# EAGLE schematic schematic (EAGLE 6.5.0)
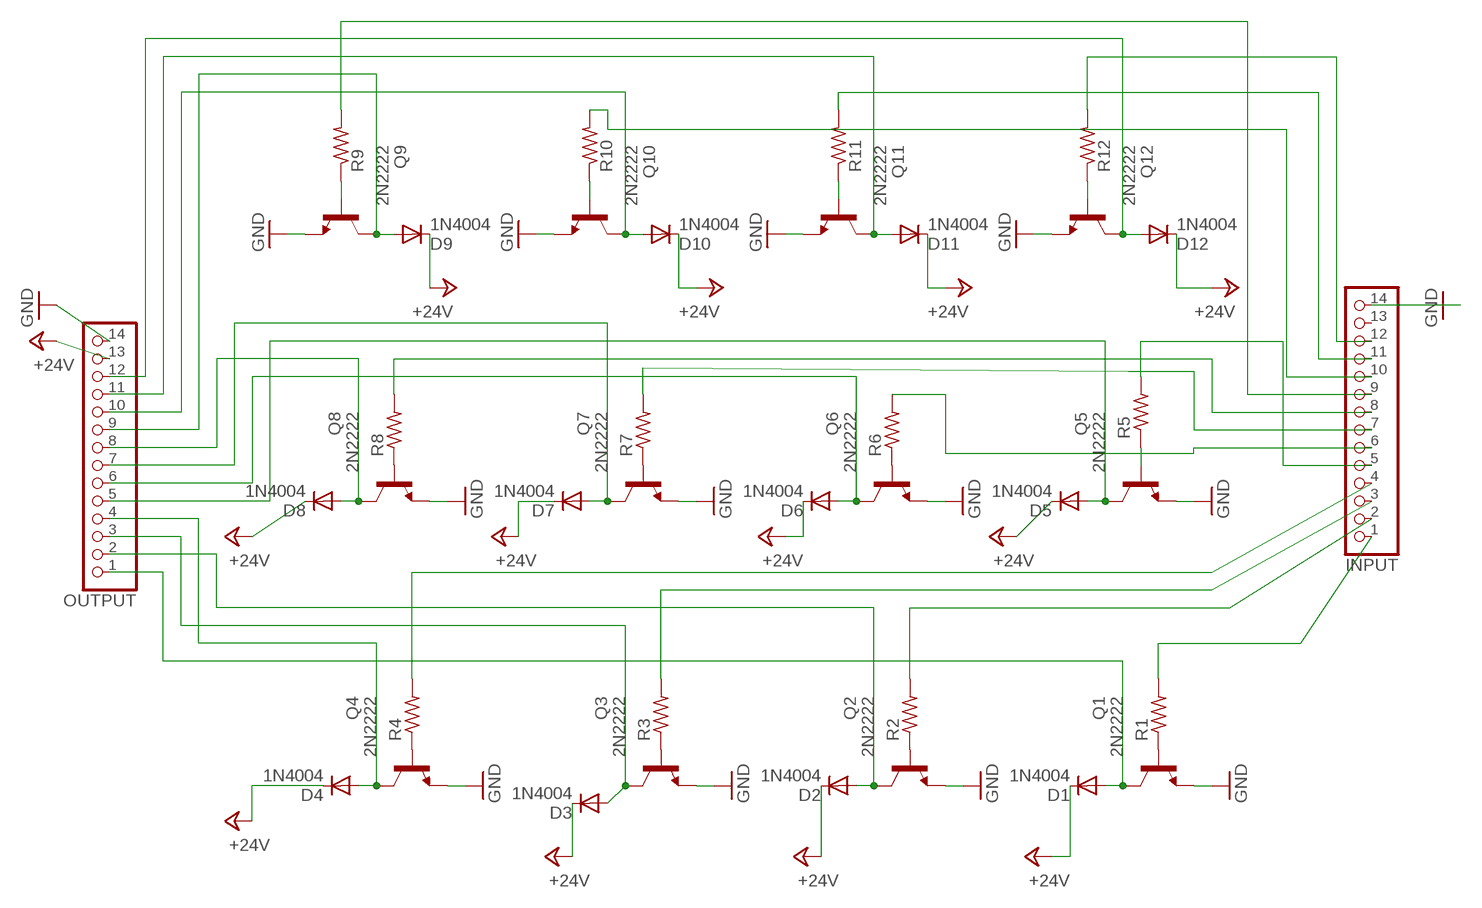
[diagram p0: schematic, sheet 1]

## Parts
D1  1N4004  [DO41-10]
D2  1N4004  [DO41-10]
D3  1N4004  [DO41-10]
D4  1N4004  [DO41-10]
D5  1N4004  [DO41-10]
D6  1N4004  [DO41-10]
D7  1N4004  [DO41-10]
D8  1N4004  [DO41-10]
D9  1N4004  [DO41-10]
D10  1N4004  [DO41-10]
D11  1N4004  [DO41-10]
D12  1N4004  [DO41-10]
INPUT  PINHD-1X14  [1X14]
OUTPUT  PINHD-1X14  [1X14]
Q1  2N2222  [TO92-EBC-OVAL]
Q2  2N2222  [TO92-EBC-OVAL]
Q3  2N2222  [TO92-EBC-OVAL]
Q4  2N2222  [TO92-EBC-OVAL]
Q5  2N2222  [TO92-EBC-OVAL]
Q6  2N2222  [TO92-EBC-OVAL]
Q7  2N2222  [TO92-EBC-OVAL]
Q8  2N2222  [TO92-EBC-OVAL]
Q9  2N2222  [TO92-EBC-OVAL]
Q10  2N2222  [TO92-EBC-OVAL]
Q11  2N2222  [TO92-EBC-OVAL]
Q12  2N2222  [TO92-EBC-OVAL]
R1  R-US_0309/12  [0309/12]
R2  R-US_0309/12  [0309/12]
R3  R-US_0309/12  [0309/12]
R4  R-US_0309/12  [0309/12]
R5  R-US_0309/12  [0309/12]
R6  R-US_0309/12  [0309/12]
R7  R-US_0309/12  [0309/12]
R8  R-US_0309/12  [0309/12]
R9  R-US_0309/12  [0309/12]
R10  R-US_0309/12  [0309/12]
R11  R-US_0309/12  [0309/12]
R12  R-US_0309/12  [0309/12]

## Nets
+24V: D1.C D2.C D3.C D4.C D5.C D6.C D7.C D8.C D9.C D10.C D11.C D12.C OUTPUT.13
GND: INPUT.14 OUTPUT.14 Q1.E Q2.E Q3.E Q4.E Q5.E Q6.E Q7.E Q8.E Q9.E Q10.E Q11.E Q12.E
N$1: D1.A OUTPUT.1 Q1.C
N$2: Q1.B R1.1
N$3: INPUT.1 R1.2
N$4: D2.A OUTPUT.2 Q2.C
N$5: Q2.B R2.1
N$6: INPUT.2 R2.2
N$7: D3.A OUTPUT.3 Q3.C
N$8: Q3.B R3.1
N$9: INPUT.3 R3.2
N$10: D4.A OUTPUT.4 Q4.C
N$11: Q4.B R4.1
N$12: INPUT.4 R4.2
N$13: D5.A OUTPUT.5 Q5.C
N$14: Q5.B R5.1
N$15: INPUT.5 R5.2
N$16: D6.A OUTPUT.6 Q6.C
N$17: Q6.B R6.1
N$18: INPUT.6 R6.2
N$19: D7.A OUTPUT.7 Q7.C
N$20: Q7.B R7.1
N$21: INPUT.7 R7.2
N$22: D8.A OUTPUT.8 Q8.C
N$23: Q8.B R8.1
N$24: INPUT.8 R8.2
N$31: D9.A OUTPUT.9 Q9.C
N$32: Q9.B R9.1
N$33: INPUT.9 R9.2
N$34: D10.A OUTPUT.10 Q10.C
N$35: Q10.B R10.1
N$36: INPUT.10 R10.2
N$37: D11.A OUTPUT.11 Q11.C
N$38: Q11.B R11.1
N$39: INPUT.11 R11.2
N$40: D12.A OUTPUT.12 Q12.C
N$41: Q12.B R12.1
N$42: INPUT.12 R12.2
Unconnected: INPUT.13

## Library data of the parts
D1-D12 = _mod_diode 2:1N4004: DIODE general purpose rectifier, 1 A; MPN: 1N4004; OC_NEWARK: 67R2154
INPUT OUTPUT = adafruit:PINHD-1X14: PIN HEADER; OC_NEWARK: unknown
Q1-Q12 = adafruit:2N2222: NPN TRANSISTOR Big oval pads; MF: FAIRCHILD SEMICONDUCTOR; MPN: PN2222ATF; OC_NEWARK: 58K2048
R1-R12 = adafruit:R-US_: RESISTOR, American symbol; OC_NEWARK: unknown

## Net classes
0 default: width 0.305 mm, drill 0.508 mm, clearance 0.254 mm